# EAGLE design ai_breakout_MCP4725 (EAGLE 7.1.0)
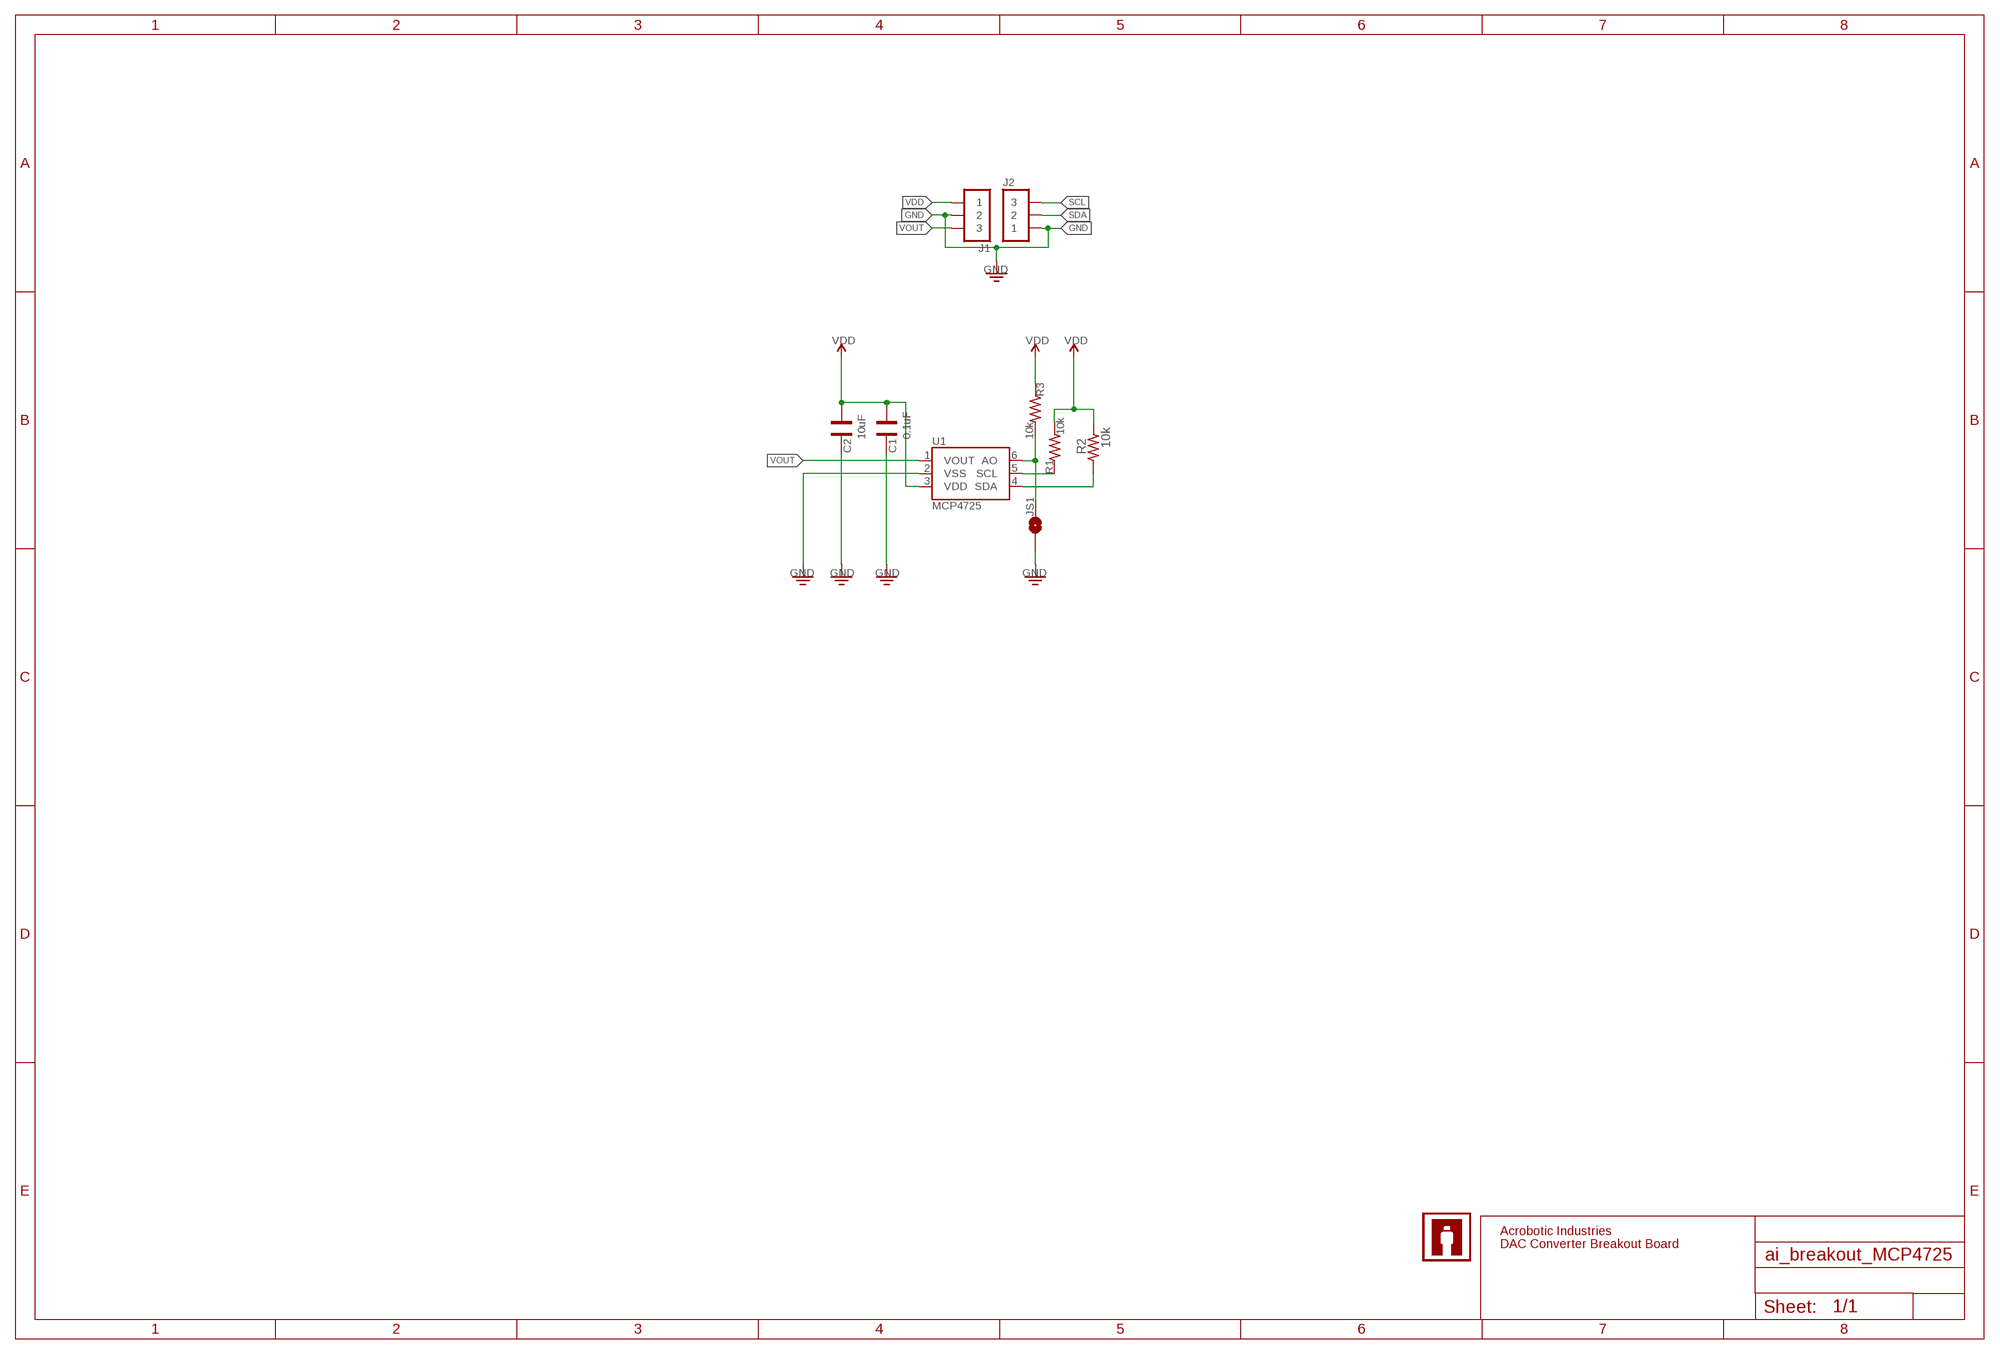
[diagram p0: schematic, sheet 1]

## Parts
C1  0.1uF  CAP0603  [CAP-0603]
C2  10uF  CAP0603  [CAP-0603]
J1  1X03  [1X03]
J2  1X03NOFIRST  [1X03-NOFIRST]
JS1  1X02-SJ-NO  [1X02-SJ-NO]
R1  10k  RES0603  [RES-0603]
R2  10k  RES0603  [RES-0603]
R3  10k  RES0603  [RES-0603]
U1  MCP4725SOT-23  [SOT23-6]
U$4  AI-LOGOXS  [AI-LOGO-XS]

## Nets
GND: C1.2 C2.2 J1.2 J2.1 JS1.1 U1.2(VSS)
SCL: J2.3 R1.1 U1.5(SCL)
SDA: J2.2 R2.1 U1.4(SDA)
VDD: C1.1 C2.1 J1.1 JS1.2 R1.2 R2.2 R3.1 R3.2 U1.3(VDD) U1.6(AO)
VOUT: J1.3 U1.1(VOUT)

## Notes on the sheet
- Acrobotic Industries
- DAC Converter Breakout Board

## Library data of the parts
C1 C2 = Ai_Passives:CAP
J1 J2 = Ai_Connectors:1X03
JS1 = Ai_Connectors:1X02-SJ-NO: A.I. Device 1x02-SJ-* NC has a large amount of paste (see paste layer) so that it should jumper during reflow. Remember that we have a version with a buil-in trace, which needs to be cut in order to have the jumper be NO.
R1-R3 = Ai_Passives:RES: Part # blah Digikey
U1 = Ai_IC:MCP4725: Microchip 12-bit I2C DAC, SOT23-6
U$4 = Ai_Miscellany:AI-LOGO

## Board
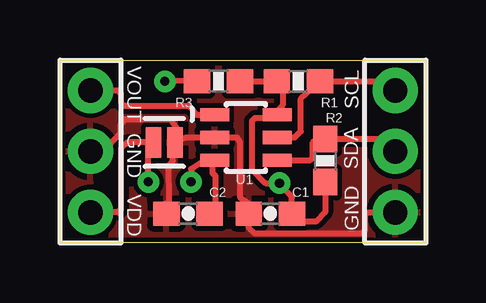
[diagram p1: board, top side]
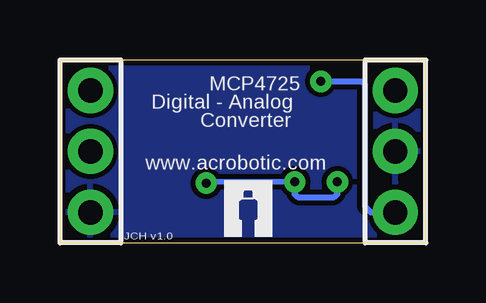
[diagram p2: board, bottom side, seen from below]

Size 15.24 x 7.62 mm. Coordinates in mm from the lower left corner, seen from the top.
Outline: 0,0 0,7.62 15.24,7.62 15.24,0 0,0
Copper layers (1*16): Top 0.035mm / dielectric 1.5mm / Bottom 0.035mm
Design rules "ai_2layer_qfn": minimum track width 7mil, minimum drill 15mil, track to track 8mil, track to pad 8mil, pad to pad 8mil, via to via 8mil, smd to smd 8mil, copper to edge 8mil, drill to drill 8mil, minimum pad ring 1mil, minimum via ring 10mil, stop-mask expansion 4mil, vias tented up to drill 20mil, thermal gap 10mil

### Footprints (pad centres in the part's own frame; a part is rotated, then mirrored left to right if it is on the bottom)
CAP-0603 = smd 1.1 x 1: 1 -0.9,0; 2 0.9,0
1X03 = drill 1.016 pad 1.88: 1 -2.54,0; 2 0,0; 3 2.54,0
1X03-NOFIRST = drill 1.016 pad 1.88: 1 -2.54,0; 2 0,0; 3 2.54,0
1X02-SJ-NO = smd 0.635 x 1.27: 1 -0.45,0; 2 0.45,0
RES-0603 = smd 1.1 x 1: 1 -0.9,0; 2 0.9,0
SOT23-6 = smd 0.55 x 1.2: 1 -0.95,-1.3; 2 0,-1.3; 3 0.95,-1.3; 4 0.95,1.3; 5 0,1.3; 6 -0.95,1.3

### Placement (x,y rotation side)
C1  8.76,1.22 180 top
C2  5.33,1.22 180 top
J1  1.27,3.81 90 top
J2  13.97,3.81 90 top
JS1  4.34,4.19 180 top
R1  9.93,6.73 180 top
R2  11.05,3.43 270 top
R3  6.6,6.73 0 top
U1  7.75,4.39 270 top
U$4  8.38,0.25 0 bottom

### Tracks (layer width: path | path; a pad name or v marks a point on that pad's centre or on a via)
GND
  Top 0.254: C2.2 4.43,1.64 4.55,1.73 4.54,3.24 4.7,3.43 4.7,4.13 JS1.1 | JS1.1 5.25,4.39 U1.2 7.37,4.39 7.49,4.19 7.49,1.91 7.87,1.64 C1.2 7.87,1.13 7.87,0.64 8.13,0.38 12.57,0.38 12.7,0.51 12.7,1.14 12.83,1.27 J2.1 | J1.2 1.78,3.81 2.54,4.6 2.54,4.95 2.69,5.16 4.6,5.16 4.83,4.83 4.83,4.22 JS1.1
  pour Bottom: 0,0 0,7.62 15.24,7.62 15.24,0
  pour Top: 0,0 0,7.62 15.24,7.62 15.24,0
SCL
  Top 0.254: U1.5 9.78,4.39 10.03,4.65 10.03,6.01 R1.1 13.59,6.73 J2.3
SDA
  Top 0.254: U1.4 10.43,3.44 10.54,3.56 10.54,4.19 10.67,4.32 11.55,4.32 R2.1 13.45,4.33 J2.2
VDD  (via drill 0.38)
  Top 0.254: J1.1 2.41,1.27 2.54,1.4 2.54,3.94 2.79,4.19 JS1.2 3.68,4.13 v3.68,2.54 | v5.46,2.54 5.46,3.07 5.91,3.37 U1.3 6.28,3.37 6.35,3.3 6.35,2.92 6.48,2.79 6.48,1.27 6.35,1.26 C2.1 | R3.1 5.97,6.72 5.93,6.75 v4.37,6.73 | R3.2 R1.2 9.27,6.6 9.27,5.74 8.89,5.37 U1.6 8.73,5.21 8.13,5.21 8,5.08 8,3.05 8.56,2.49 v9.14,2.49 9.66,1.89 C1.1 9.66,0.89 10.67,0.89 11.05,1.27 R2.2
  Bottom 0.254: v3.68,2.54 3.68,2.03 3.81,1.91 5.33,1.91 5.46,2.03 v5.46,2.54 9.09,2.56 v9.14,2.49 | v4.37,6.73 2.67,6.73 2.54,6.6 2.54,1.52 2.29,1.27 J1.1
VOUT
  Top 0.254: J1.3 2.41,6.35 2.54,6.22 2.54,5.84 2.67,5.71 5.36,5.71 5.46,5.61 5.71,5.33 6.13,5.33 U1.1

### Text on the board
tNames: VOUT | SCL | GND | SDA | VDD | GND
bNames: MCP4725 | Digital - Analog | Converter | www.acrobotic.com | JCH v1.0